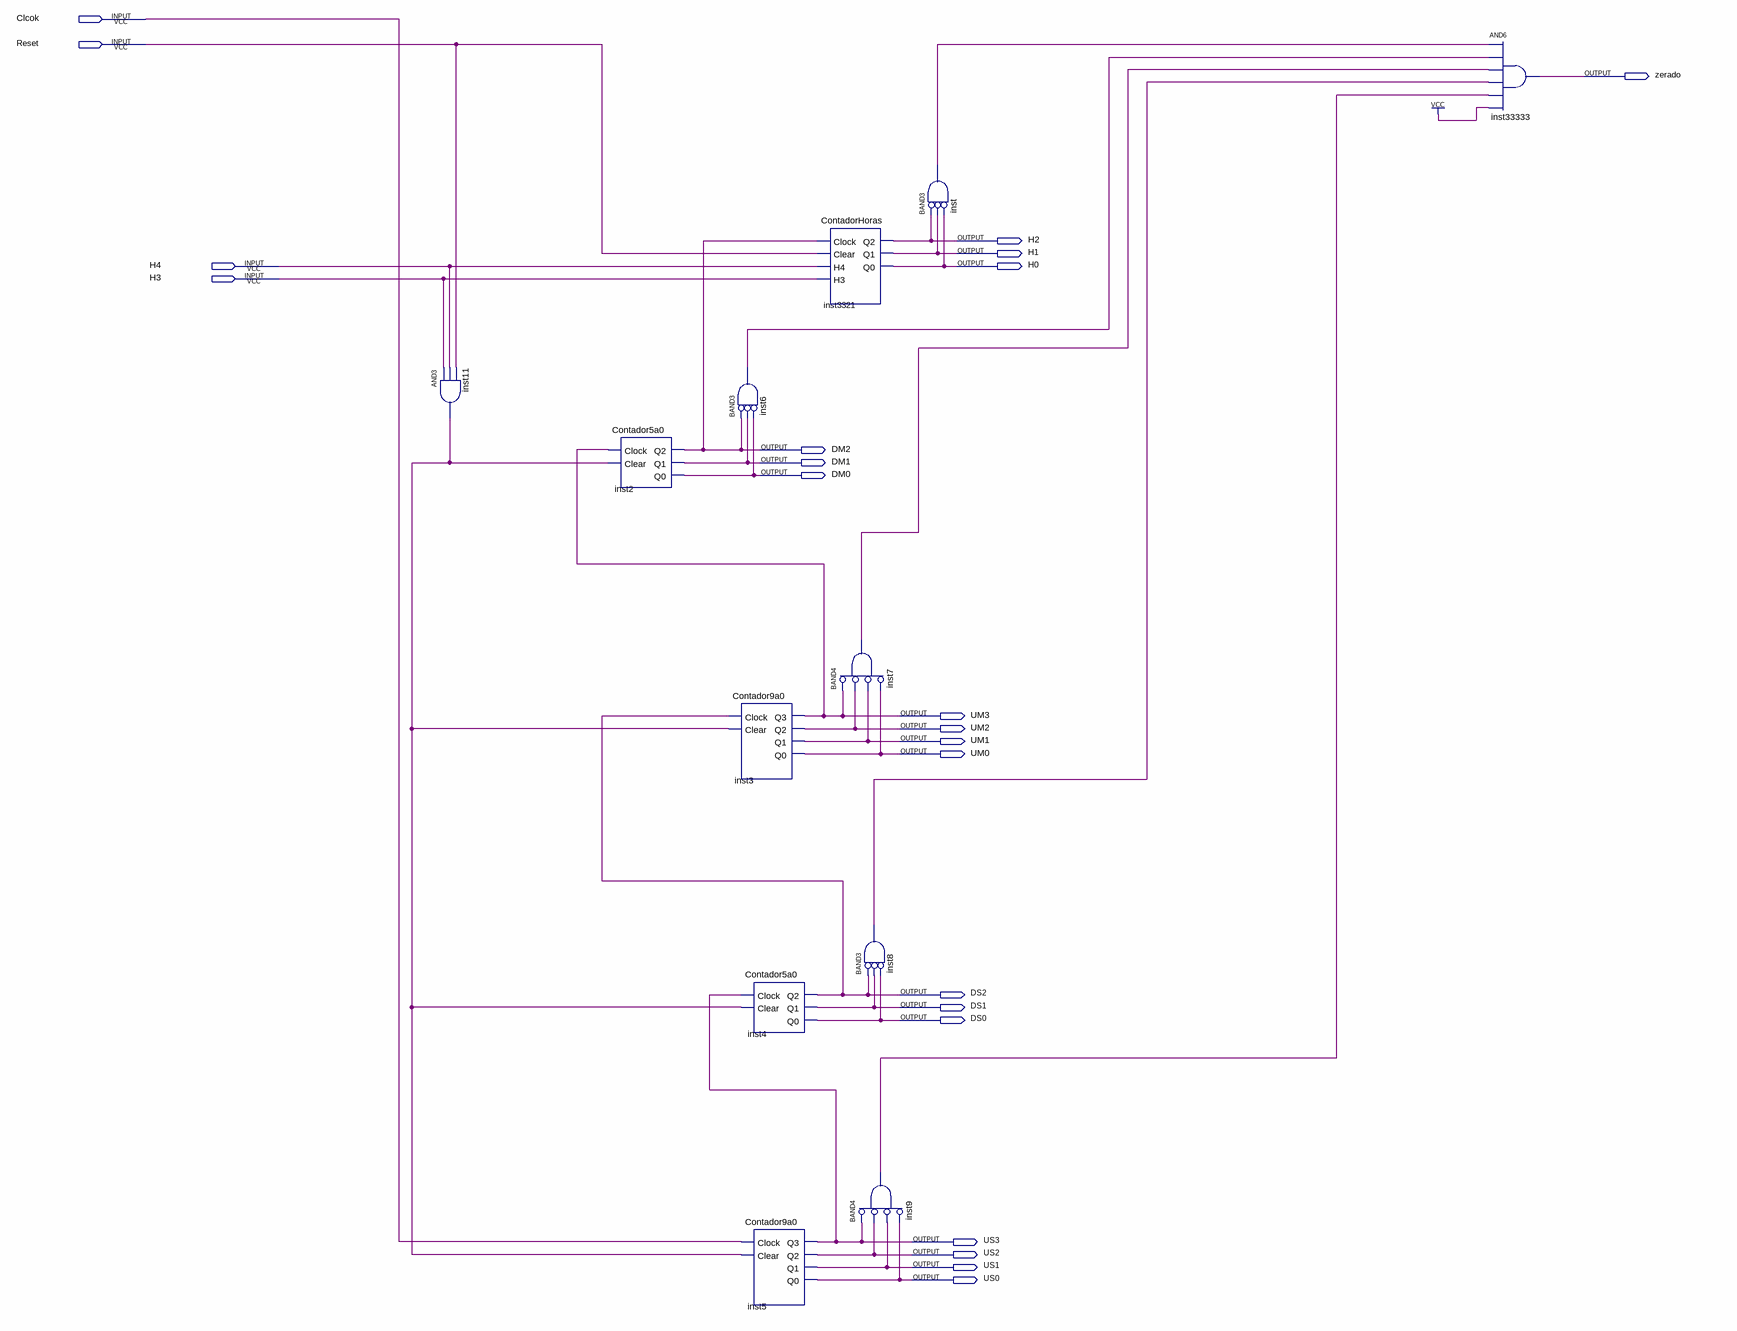
[diagram p0: schematic sheet]
// Quartus schematic Timer.bdf as structural Verilog: 12 symbols, 22 pins
module Timer (
  input  Clcok,
  input  Reset,
  input  H4,
  input  H3,
  output zerado,
  output H2,
  output H1,
  output H0,
  output DM2,
  output DM1,
  output DM0,
  output UM3,
  output UM2,
  output UM1,
  output UM0,
  output DS2,
  output DS1,
  output DS0,
  output US3,
  output US2,
  output US1,
  output US0
);

  wire inst6_out, inst7_out, inst8_out, inst9_out, inst11_out, inst_out;

  and inst11 (inst11_out, H3, H4, Reset);
  Contador5a0 inst2 (.Clock(UM3), .Clear(inst11_out), .Q2(DM2), .Q1(DM1), .Q0(DM0));
  and inst6 (inst6_out, ~DM2, ~DM1, ~DM0);  // BAND3
  Contador9a0 inst3 (.Clock(DS2), .Clear(inst11_out), .Q3(UM3), .Q2(UM2), .Q1(UM1), .Q0(UM0));
  Contador5a0 inst4 (.Clock(US3), .Clear(inst11_out), .Q2(DS2), .Q1(DS1), .Q0(DS0));
  Contador9a0 inst5 (.Clock(Clcok), .Clear(inst11_out), .Q3(US3), .Q2(US2), .Q1(US1), .Q0(US0));
  ContadorHoras inst3321 (.Clock(DM2), .Clear(Reset), .H4(H4), .H3(H3), .Q2(H2), .Q1(H1), .Q0(H0));
  and inst7 (inst7_out, ~UM3, ~UM2, ~UM1, ~UM0);  // BAND4
  and inst8 (inst8_out, ~DS2, ~DS1, ~DS0);  // BAND3
  and inst9 (inst9_out, ~US3, ~US2, ~US1, ~US0);  // BAND4
  and inst (inst_out, ~H2, ~H1, ~H0);  // BAND3
  and inst33333 (zerado, inst_out, inst6_out, inst7_out, inst8_out, inst9_out, 1'b1);
endmodule
